# Altium schematic sheet 10_Speed.SchDoc
size A3; SheetNumber: 2; SheetTotal: 12
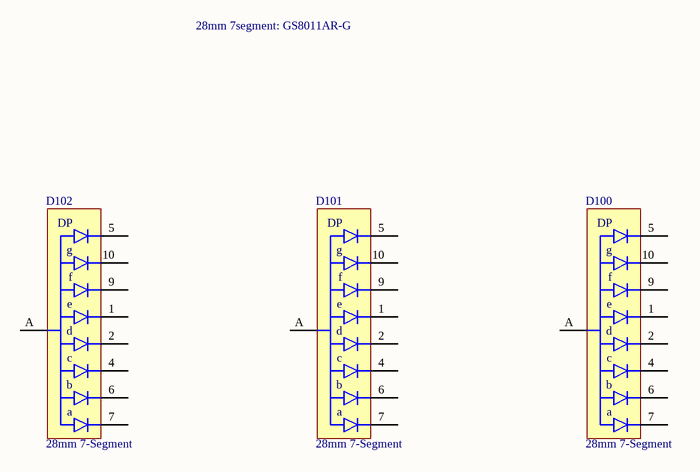
[diagram p0: 10_Speed.SchDoc]

## Parts
D100  28mm 7-Segment  [GS8011AR-G]
D101  28mm 7-Segment  [GS8011AR-G]
D102  28mm 7-Segment  [GS8011AR-G]

## Nets

Not connected (* = marked no-connect by the designer): D100 1 2 4 5 6 7 9 10 A; D101 1 2 4 5 6 7 9 10 A; D102 1 2 4 5 6 7 9 10 A

## Notes on the sheet
- 28mm 7segment: GS8011AR-G
- (in symbol GS8011AR-G) DP; g; f; e; d; c; b; a

## Library data of the parts
D100-D102 = GS8011AR-G: SMD, 28x16.8mm 7-Segment